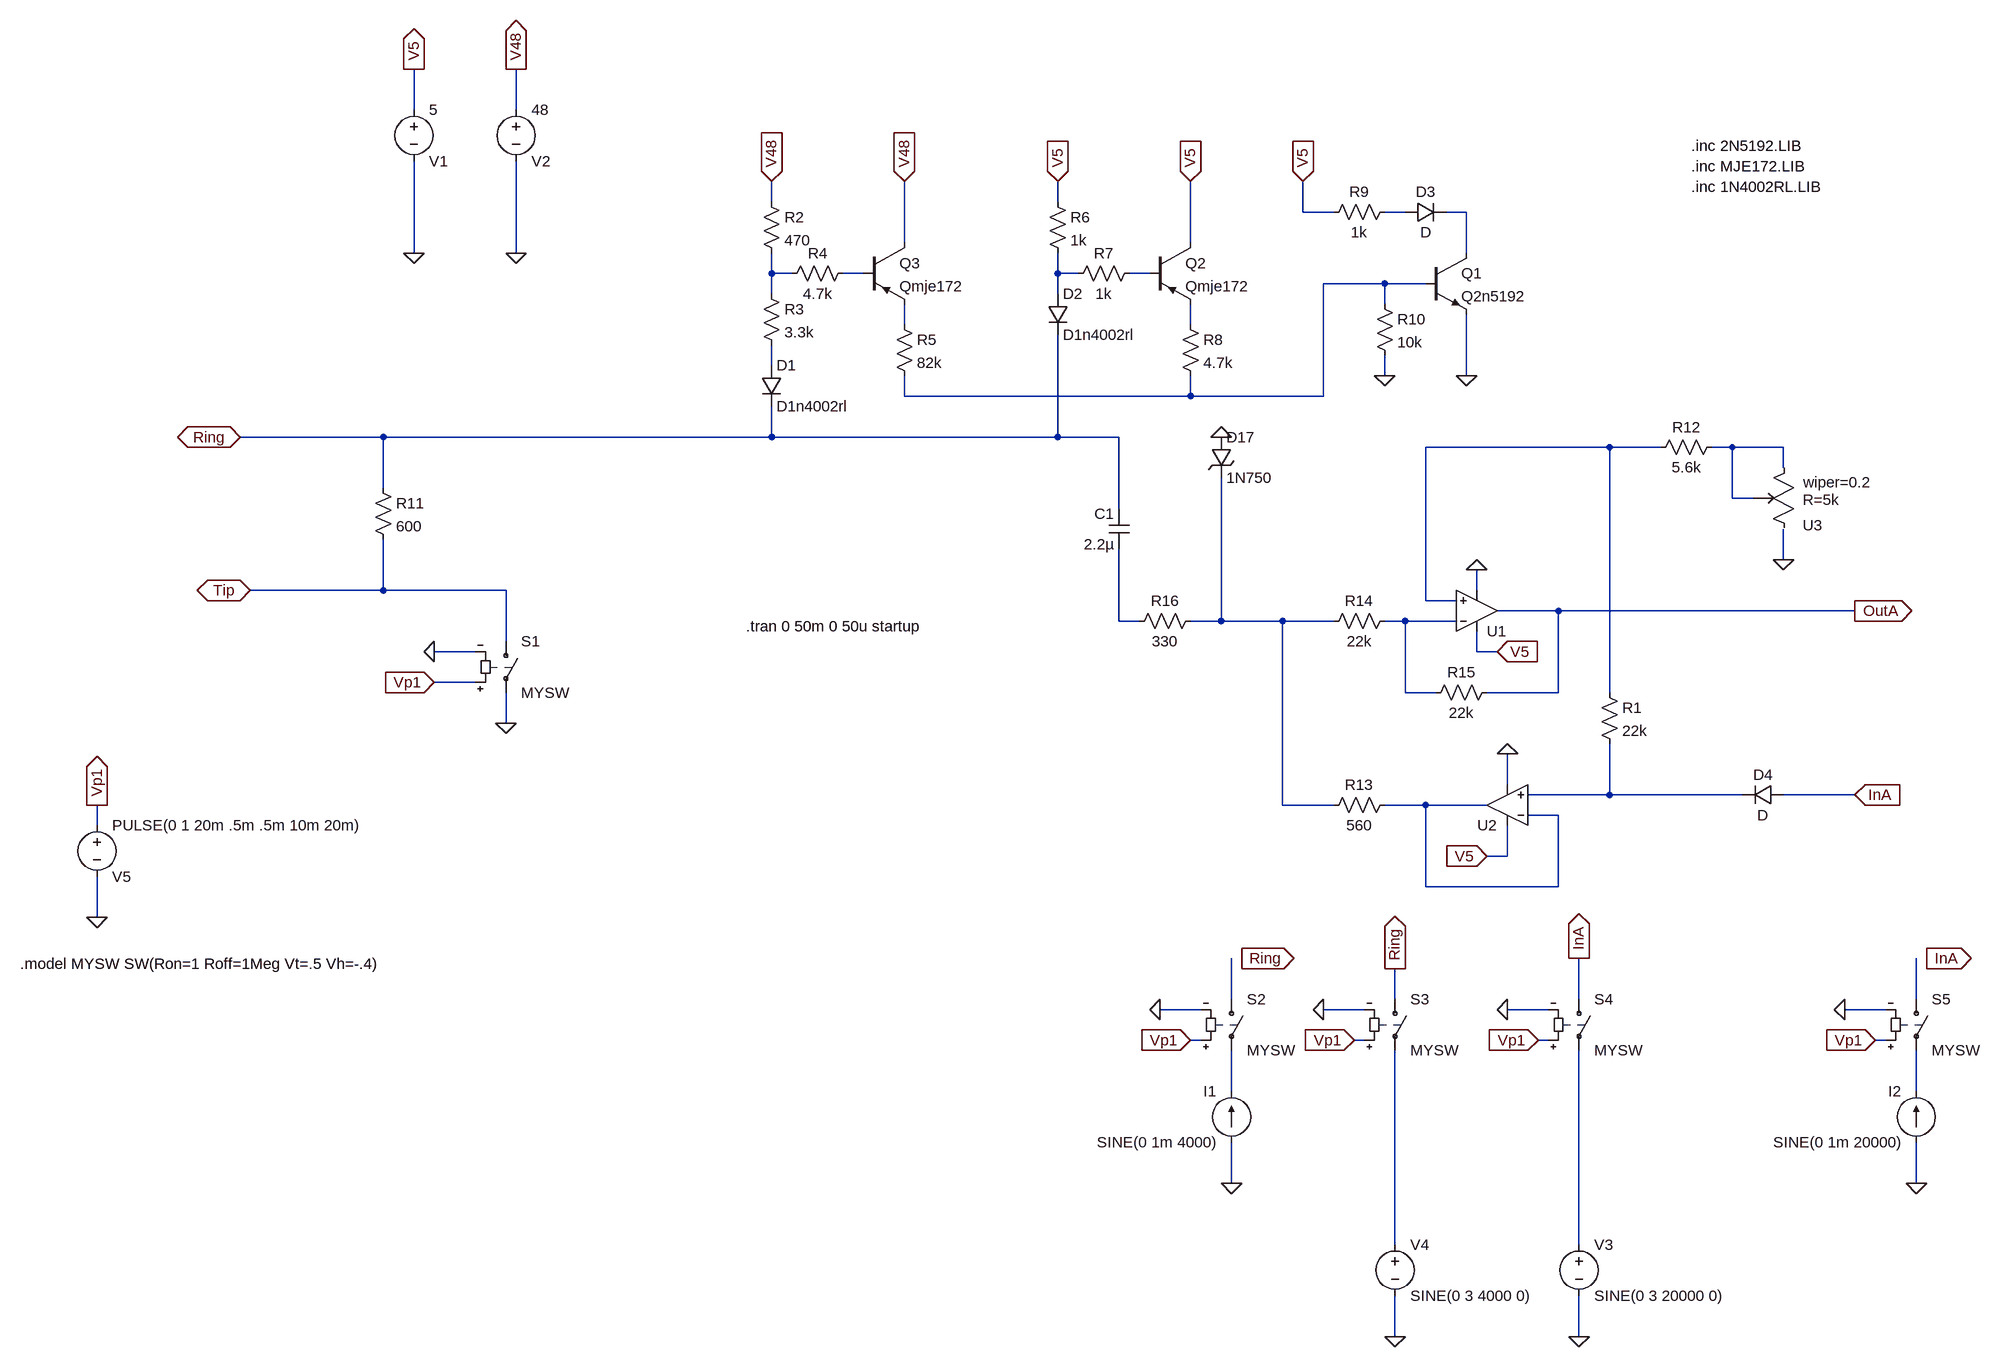
[diagram p0: schematic hybrid_test.asc]
hybrid_test.asc, the LTspice schematic file:
Version 4
SHEET 1 1424 1284
WIRE -1392 -656 -1392 -720
WIRE -1232 -656 -1232 -720
WIRE -832 -512 -832 -544
WIRE -384 -512 -384 -544
WIRE 0 -496 0 -544
WIRE 48 -496 0 -496
WIRE 160 -496 128 -496
WIRE 256 -496 224 -496
WIRE -624 -448 -624 -544
WIRE -176 -448 -176 -544
WIRE -1392 -432 -1392 -576
WIRE -1232 -432 -1232 -576
WIRE 256 -432 256 -496
WIRE -832 -400 -832 -432
WIRE -800 -400 -832 -400
WIRE -688 -400 -720 -400
WIRE -384 -400 -384 -432
WIRE -352 -400 -384 -400
WIRE -240 -400 -272 -400
WIRE 128 -384 32 -384
WIRE 192 -384 128 -384
WIRE -832 -368 -832 -400
WIRE -384 -368 -384 -400
WIRE 128 -352 128 -384
WIRE -624 -320 -624 -352
WIRE -176 -320 -176 -352
WIRE -832 -256 -832 -288
WIRE 128 -240 128 -272
WIRE 256 -240 256 -336
WIRE -624 -208 -624 -240
WIRE -176 -208 -176 -240
WIRE -176 -208 -624 -208
WIRE 32 -208 32 -384
WIRE 32 -208 -176 -208
WIRE -1440 -144 -1664 -144
WIRE -832 -144 -832 -192
WIRE -832 -144 -1440 -144
WIRE -384 -144 -384 -304
WIRE -384 -144 -832 -144
WIRE -288 -144 -384 -144
WIRE 480 -128 192 -128
WIRE 560 -128 480 -128
WIRE 672 -128 640 -128
WIRE 752 -128 672 -128
WIRE 752 -96 752 -128
WIRE -1440 -64 -1440 -144
WIRE 672 -48 672 -128
WIRE 704 -48 672 -48
WIRE -288 -32 -288 -144
WIRE 752 48 752 0
WIRE -1440 96 -1440 16
WIRE -1440 96 -1648 96
WIRE -1248 96 -1440 96
WIRE 272 96 272 64
WIRE 192 112 192 -128
WIRE 240 112 192 112
WIRE 400 128 304 128
WIRE 864 128 400 128
WIRE -288 144 -288 32
WIRE -256 144 -288 144
WIRE -128 144 -128 -80
WIRE -128 144 -176 144
WIRE -32 144 -128 144
WIRE 48 144 -32 144
WIRE 160 144 128 144
WIRE 240 144 160 144
WIRE -1248 176 -1248 96
WIRE -1296 192 -1360 192
WIRE 272 192 272 160
WIRE 304 192 272 192
WIRE -1296 240 -1360 240
WIRE 160 256 160 144
WIRE 208 256 160 256
WIRE 400 256 400 128
WIRE 400 256 288 256
WIRE 480 256 480 -128
WIRE -1248 304 -1248 256
WIRE 320 400 320 352
WIRE 480 416 480 336
WIRE 480 416 352 416
WIRE 688 416 480 416
WIRE 864 416 752 416
WIRE -32 432 -32 144
WIRE 48 432 -32 432
WIRE 192 432 128 432
WIRE 288 432 192 432
WIRE 400 448 352 448
WIRE -1888 464 -1888 432
WIRE 320 512 320 464
WIRE 320 512 288 512
WIRE 192 560 192 432
WIRE 400 560 400 448
WIRE 400 560 192 560
WIRE -1888 608 -1888 544
WIRE -112 736 -112 672
WIRE 144 736 144 688
WIRE 432 736 432 672
WIRE 960 736 960 672
WIRE -160 752 -224 752
WIRE 96 752 32 752
WIRE 384 752 320 752
WIRE 912 752 848 752
WIRE -160 800 -176 800
WIRE 96 800 80 800
WIRE 384 800 368 800
WIRE 912 800 896 800
WIRE -112 880 -112 816
WIRE 960 880 960 816
WIRE -112 1024 -112 960
WIRE 960 1024 960 960
WIRE 144 1120 144 816
WIRE 432 1120 432 816
WIRE 144 1264 144 1200
WIRE 432 1264 432 1200
FLAG -624 -544 V48
IOPIN -624 -544 In
FLAG -832 -544 V48
IOPIN -832 -544 In
FLAG -384 -544 V5
IOPIN -384 -544 In
FLAG -176 -544 V5
IOPIN -176 -544 In
FLAG 0 -544 V5
IOPIN 0 -544 In
FLAG 128 -240 0
FLAG 256 -240 0
FLAG -1664 -144 Ring
IOPIN -1664 -144 BiDir
FLAG -1648 96 Tip
IOPIN -1648 96 BiDir
FLAG -1232 -432 0
FLAG -1392 -432 0
FLAG -1392 -720 V5
IOPIN -1392 -720 Out
FLAG -1232 -720 V48
IOPIN -1232 -720 Out
FLAG 304 192 V5
IOPIN 304 192 In
FLAG 272 64 0
FLAG 320 352 0
FLAG 288 512 V5
IOPIN 288 512 In
FLAG 752 48 0
FLAG 864 128 OutA
IOPIN 864 128 Out
FLAG 864 416 InA
IOPIN 864 416 In
FLAG 432 1264 0
FLAG 144 1264 0
FLAG -112 1024 0
FLAG 144 688 Ring
IOPIN 144 688 Out
FLAG 432 672 InA
IOPIN 432 672 Out
FLAG 960 1024 0
FLAG -96 672 Ring
IOPIN -96 672 Out
FLAG 976 672 InA
IOPIN 976 672 Out
FLAG -1888 608 0
FLAG -1888 432 Vp1
IOPIN -1888 432 Out
FLAG -1248 304 0
FLAG -1360 192 0
FLAG -1360 240 Vp1
IOPIN -1360 240 In
FLAG -224 752 0
FLAG -176 800 Vp1
IOPIN -176 800 In
FLAG 32 752 0
FLAG 80 800 Vp1
IOPIN 80 800 In
FLAG 320 752 0
FLAG 368 800 Vp1
IOPIN 368 800 In
FLAG 848 752 0
FLAG 896 800 Vp1
IOPIN 896 800 In
FLAG -128 -144 0
SYMBOL OpAmps\\UniversalOpAmp 272 128 M180
SYMATTR InstName U1
SYMBOL OpAmps\\UniversalOpAmp 320 432 R180
SYMATTR InstName U2
SYMBOL potentiometer 752 -96 M180
SYMATTR InstName U3
SYMATTR SpiceLine2 wiper=0.2
SYMATTR SpiceLine R=5k
SYMBOL res -848 -528 R0
SYMATTR InstName R2
SYMATTR Value 470
SYMBOL res -848 -384 R0
SYMATTR InstName R3
SYMATTR Value 3.3k
SYMBOL res -704 -416 R90
WINDOW 0 0 56 VBottom 2
WINDOW 3 32 56 VTop 2
SYMATTR InstName R4
SYMATTR Value 4.7k
SYMBOL res -640 -336 R0
SYMATTR InstName R5
SYMATTR Value 82k
SYMBOL res -400 -528 R0
SYMATTR InstName R6
SYMATTR Value 1k
SYMBOL res -256 -416 R90
WINDOW 0 0 56 VBottom 2
WINDOW 3 32 56 VTop 2
SYMATTR InstName R7
SYMATTR Value 1k
SYMBOL res -192 -336 R0
SYMATTR InstName R8
SYMATTR Value 4.7k
SYMBOL res 144 -512 R90
WINDOW 0 0 56 VBottom 2
WINDOW 3 32 56 VTop 2
SYMATTR InstName R9
SYMATTR Value 1k
SYMBOL res 112 -368 R0
SYMATTR InstName R10
SYMATTR Value 10k
SYMBOL npn 192 -432 R0
SYMATTR InstName Q1
SYMATTR Value Q2n5192
SYMBOL pnp -240 -448 R0
SYMATTR InstName Q2
SYMATTR Value Qmje172
SYMBOL pnp -688 -448 R0
SYMATTR InstName Q3
SYMATTR Value Qmje172
SYMBOL diode -848 -256 R0
SYMATTR InstName D1
SYMATTR Value D1n4002rl
SYMBOL diode -400 -368 R0
SYMATTR InstName D2
SYMATTR Value D1n4002rl
SYMBOL diode 160 -480 R270
WINDOW 0 32 32 VTop 2
WINDOW 3 0 32 VBottom 2
SYMATTR InstName D3
SYMBOL res -1456 -80 R0
SYMATTR InstName R11
SYMATTR Value 600
SYMBOL voltage -1392 -672 R0
WINDOW 0 24 96 Left 2
WINDOW 3 24 16 Left 2
WINDOW 123 0 0 Left 2
WINDOW 39 0 0 Left 2
SYMATTR InstName V1
SYMATTR Value 5
SYMBOL voltage -1232 -672 R0
WINDOW 0 24 96 Left 2
WINDOW 3 24 16 Left 2
WINDOW 123 0 0 Left 2
WINDOW 39 0 0 Left 2
SYMATTR InstName V2
SYMATTR Value 48
SYMBOL res 464 240 R0
SYMATTR InstName R1
SYMATTR Value 22k
SYMBOL res 656 -144 R90
WINDOW 0 0 56 VBottom 2
WINDOW 3 32 56 VTop 2
SYMATTR InstName R12
SYMATTR Value 5.6k
SYMBOL res 144 416 R90
WINDOW 0 0 56 VBottom 2
WINDOW 3 32 56 VTop 2
SYMATTR InstName R13
SYMATTR Value 560
SYMBOL res 144 128 R90
WINDOW 0 0 56 VBottom 2
WINDOW 3 32 56 VTop 2
SYMATTR InstName R14
SYMATTR Value 22k
SYMBOL res 304 240 R90
WINDOW 0 0 56 VBottom 2
WINDOW 3 32 56 VTop 2
SYMATTR InstName R15
SYMATTR Value 22k
SYMBOL voltage 432 1104 R0
WINDOW 123 0 0 Left 0
WINDOW 39 0 0 Left 0
SYMATTR InstName V3
SYMATTR Value SINE(0 3 20000 0)
SYMBOL voltage 144 1104 R0
WINDOW 123 0 0 Left 0
WINDOW 39 0 0 Left 0
SYMATTR InstName V4
SYMATTR Value SINE(0 3 4000 0)
SYMBOL current -112 960 R180
WINDOW 0 24 80 Left 2
WINDOW 3 24 0 Left 2
WINDOW 123 0 0 Left 0
WINDOW 39 0 0 Left 0
SYMATTR InstName I1
SYMATTR Value SINE(0 1m 4000)
SYMBOL current 960 960 R180
WINDOW 0 24 80 Left 2
WINDOW 3 24 0 Left 2
WINDOW 123 0 0 Left 0
WINDOW 39 0 0 Left 0
SYMATTR InstName I2
SYMATTR Value SINE(0 1m 20000)
SYMBOL cap -272 32 R180
WINDOW 0 24 56 Left 2
WINDOW 3 24 8 Left 2
SYMATTR InstName C1
SYMATTR Value 2.2µ
SYMBOL sw -1248 160 R0
SYMATTR InstName S1
SYMATTR Value MYSW
SYMBOL voltage -1888 448 R0
WINDOW 0 24 96 Left 2
WINDOW 3 24 16 Left 2
WINDOW 123 0 0 Left 2
WINDOW 39 0 0 Left 2
SYMATTR InstName V5
SYMATTR Value PULSE(0 1 20m .5m .5m 10m 20m)
SYMBOL sw -112 720 R0
SYMATTR InstName S2
SYMATTR Value MYSW
SYMBOL sw 144 720 R0
SYMATTR InstName S3
SYMATTR Value MYSW
SYMBOL sw 432 720 R0
SYMATTR InstName S4
SYMATTR Value MYSW
SYMBOL sw 960 720 R0
SYMATTR InstName S5
SYMATTR Value MYSW
SYMBOL zener -144 -144 R0
SYMATTR InstName D17
SYMATTR Value 1N750
SYMBOL res -160 128 R90
WINDOW 0 0 56 VBottom 2
WINDOW 3 32 56 VTop 2
SYMATTR InstName R16
SYMATTR Value 330
SYMBOL diode 752 400 R90
WINDOW 0 0 32 VBottom 2
WINDOW 3 32 32 VTop 2
SYMATTR InstName D4
TEXT -872 152 Left 2 !.tran 0 50m 0 50u startup
TEXT 608 -568 Left 2 !.inc MJE172.LIB
TEXT 608 -600 Left 2 !.inc 2N5192.LIB
TEXT 608 -536 Left 2 !.inc 1N4002RL.LIB
TEXT -2008 680 Left 2 !.model MYSW SW(Ron=1 Roff=1Meg Vt=.5 Vh=-.4)

The netlist it stands for:
* hybrid_test.asc
XU1 N011 N015 V5 0 OutA level1 Avol=1Meg GBW=10Meg Vos=0 En=0 Enk=0 In=0 Ink=0 Rin=500Meg  ; pins In+ In- V+ V- OUT
XU2 N016 N017 V5 0 N017 level1 Avol=1Meg GBW=10Meg Vos=0 En=0 Enk=0 In=0 Ink=0 Rin=500Meg  ; pins In+ In- V+ V- OUT
XU3 0 N012 N012 potentiometer R=5k wiper=0.2  ; pins 1 2 3
R2 V48 N003 470
R3 N003 N010 3.3k
R4 N004 N003 4.7k
R5 N008 N007 82k
R6 V5 N005 1k
R7 N006 N005 1k
R8 N009 N007 4.7k
R9 N001 V5 1k
R10 N007 0 10k
Q1 N002 N007 0 0 Q2n5192
Q2 V5 N006 N009 0 Qmje172
Q3 V48 N004 N008 0 Qmje172
D1 N010 Ring D1n4002rl
D2 N005 Ring D1n4002rl
D3 N001 N002 D
R11 Ring Tip 600
V1 V5 0 5
V2 V48 0 48
R1 N011 N016 22k
R12 N012 N011 5.6k
R13 N017 N014 560
R14 N015 N014 22k
R15 OutA N015 22k
V3 N023 0 SINE(0 3 20000 0)
V4 N022 0 SINE(0 3 4000 0)
I1 0 N020 SINE(0 1m 4000)
I2 0 N021 SINE(0 1m 20000)
C1 N013 Ring 2.2µ
S1 Tip 0 Vp1 0 MYSW
V5 Vp1 0 PULSE(0 1 20m .5m .5m 10m 20m)
S2 N018 N020 Vp1 0 MYSW
S3 Ring N022 Vp1 0 MYSW
S4 InA N023 Vp1 0 MYSW
S5 N019 N021 Vp1 0 MYSW
D17 0 N014 1N750
R16 N014 N013 330
D4 InA N016 D
.model D D
.lib standard.dio
.model NPN NPN
.model PNP PNP
.lib standard.bjt
.tran 0 50m 0 50u startup
.inc MJE172.LIB
.inc 2N5192.LIB
.inc 1N4002RL.LIB
.model MYSW SW(Ron=1 Roff=1Meg Vt=.5 Vh=-.4)
.lib UniversalOpAmp1.lib
.lib potentiometer.lib
.backanno
.end